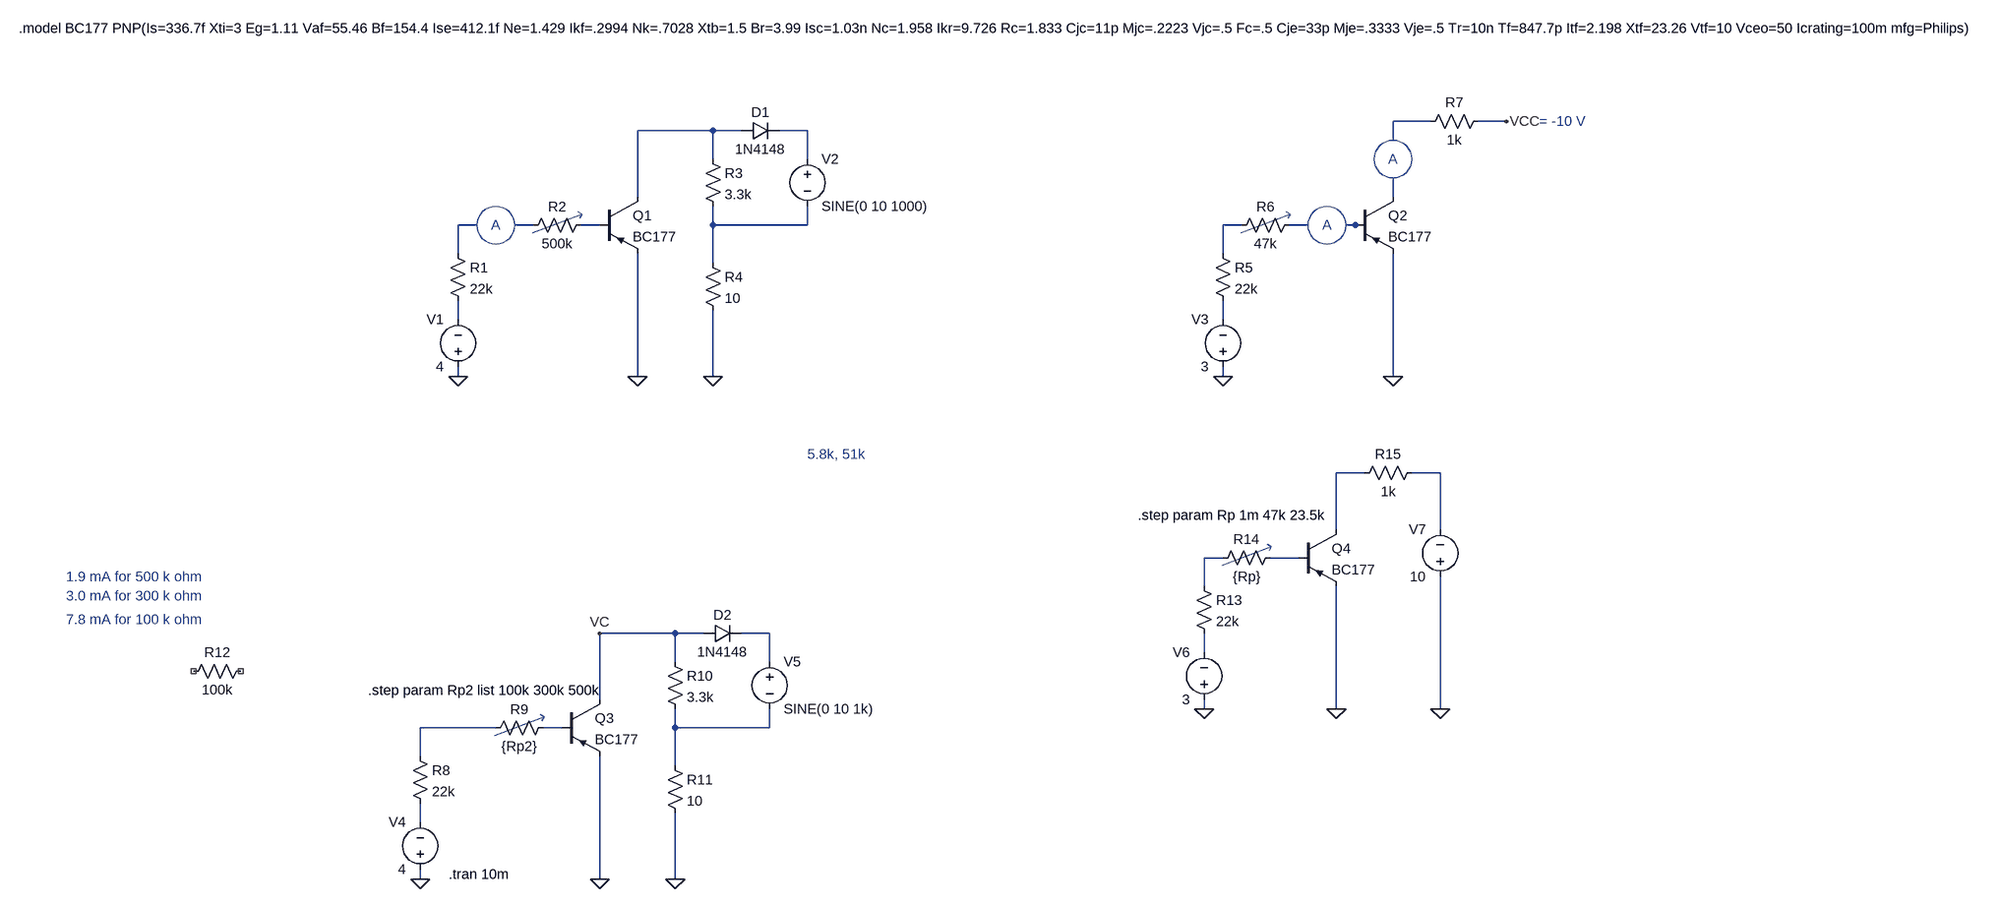
[diagram p0: schematic pre3.asc]
pre3.asc, the LTspice schematic file:
Version 4.1
SHEET 1 2712 1288
WIRE 1648 -224 1584 -224
WIRE 1776 -224 1728 -224
WIRE 432 -208 304 -208
WIRE 480 -208 432 -208
WIRE 592 -208 544 -208
WIRE 1584 -192 1584 -224
WIRE 432 -160 432 -208
WIRE 592 -160 592 -208
WIRE 304 -96 304 -208
WIRE 1584 -96 1584 -128
WIRE 32 -48 0 -48
WIRE 128 -48 96 -48
WIRE 240 -48 208 -48
WIRE 432 -48 432 -80
WIRE 592 -48 592 -80
WIRE 592 -48 432 -48
WIRE 1328 -48 1296 -48
WIRE 1440 -48 1408 -48
WIRE 1520 -48 1504 -48
WIRE 1536 -48 1520 -48
WIRE 0 0 0 -48
WIRE 1296 0 1296 -48
WIRE 432 16 432 -48
WIRE 0 112 0 80
WIRE 1296 112 1296 80
WIRE 0 208 0 192
WIRE 304 208 304 0
WIRE 432 208 432 96
WIRE 1296 208 1296 192
WIRE 1584 208 1584 0
WIRE 1536 560 1488 560
WIRE 1664 560 1616 560
WIRE 1488 656 1488 560
WIRE 1664 656 1664 560
WIRE 1296 704 1264 704
WIRE 1424 704 1376 704
WIRE 1264 752 1264 704
WIRE 368 832 240 832
WIRE 416 832 368 832
WIRE 528 832 480 832
WIRE 1264 864 1264 832
WIRE 368 880 368 832
WIRE 528 880 528 832
WIRE 240 944 240 832
WIRE 1264 960 1264 944
WIRE 1488 960 1488 752
WIRE 1664 960 1664 736
WIRE 64 992 -64 992
WIRE 176 992 144 992
WIRE 368 992 368 960
WIRE 528 992 528 960
WIRE 528 992 368 992
WIRE -64 1040 -64 992
WIRE 368 1056 368 992
WIRE -64 1152 -64 1120
WIRE -64 1248 -64 1232
WIRE 240 1248 240 1040
WIRE 368 1248 368 1136
FLAG 304 208 0
FLAG 0 208 0
FLAG 432 208 0
FLAG 1584 208 0
FLAG 1296 208 0
FLAG 1776 -224 VCC
FLAG 240 1248 0
FLAG -64 1248 0
FLAG 368 1248 0
FLAG 240 832 VC
FLAG 1488 960 0
FLAG 1264 960 0
FLAG 1664 960 0
SYMBOL voltage 0 208 R180
WINDOW 0 24 96 Left 2
WINDOW 3 24 16 Left 2
WINDOW 123 0 0 Left 0
WINDOW 39 0 0 Left 0
SYMATTR InstName V1
SYMATTR Value 4
SYMBOL res -16 -16 R0
SYMATTR InstName R1
SYMATTR Value 22k
SYMBOL res 224 -64 R90
WINDOW 0 0 56 VBottom 2
WINDOW 3 32 56 VTop 2
SYMATTR InstName R2
SYMATTR Value 500k
SYMBOL pnp 240 -96 R0
SYMATTR InstName Q1
SYMATTR Value BC177
SYMBOL res 416 -176 R0
SYMATTR InstName R3
SYMATTR Value 3.3k
SYMBOL res 416 0 R0
SYMATTR InstName R4
SYMATTR Value 10
SYMBOL voltage 592 -176 R0
WINDOW 123 0 0 Left 0
WINDOW 39 0 0 Left 0
SYMATTR InstName V2
SYMATTR Value SINE(0 10 1000)
SYMBOL diode 480 -192 R270
WINDOW 0 32 32 VTop 2
WINDOW 3 0 32 VBottom 2
SYMATTR InstName D1
SYMATTR Value 1N4148
SYMBOL voltage 1296 208 R180
WINDOW 0 24 96 Left 2
WINDOW 3 24 16 Left 2
WINDOW 123 0 0 Left 0
WINDOW 39 0 0 Left 0
SYMATTR InstName V3
SYMATTR Value 3
SYMBOL res 1280 -16 R0
SYMATTR InstName R5
SYMATTR Value 22k
SYMBOL res 1424 -64 R90
WINDOW 0 0 56 VBottom 2
WINDOW 3 32 56 VTop 2
SYMATTR InstName R6
SYMATTR Value 47k
SYMBOL pnp 1520 -96 R0
SYMATTR InstName Q2
SYMATTR Value BC177
SYMBOL res 1744 -240 R90
WINDOW 0 0 56 VBottom 2
WINDOW 3 32 56 VTop 2
SYMATTR InstName R7
SYMATTR Value 1k
SYMBOL voltage -64 1248 R180
WINDOW 0 24 96 Left 2
WINDOW 3 24 16 Left 2
WINDOW 123 0 0 Left 0
WINDOW 39 0 0 Left 0
SYMATTR InstName V4
SYMATTR Value 4
SYMBOL res -80 1024 R0
SYMATTR InstName R8
SYMATTR Value 22k
SYMBOL res 160 976 R90
WINDOW 0 0 56 VBottom 2
WINDOW 3 32 56 VTop 2
SYMATTR InstName R9
SYMATTR Value {Rp2}
SYMBOL pnp 176 944 R0
SYMATTR InstName Q3
SYMATTR Value BC177
SYMBOL res 352 864 R0
SYMATTR InstName R10
SYMATTR Value 3.3k
SYMBOL res 352 1040 R0
SYMATTR InstName R11
SYMATTR Value 10
SYMBOL voltage 528 864 R0
WINDOW 123 0 0 Left 0
WINDOW 39 0 0 Left 0
SYMATTR InstName V5
SYMATTR Value SINE(0 10 1k)
SYMBOL diode 416 848 R270
WINDOW 0 32 32 VTop 2
WINDOW 3 0 32 VBottom 2
SYMATTR InstName D2
SYMATTR Value 1N4148
SYMBOL res -352 880 R90
WINDOW 0 0 56 VBottom 2
WINDOW 3 32 56 VTop 2
SYMATTR InstName R12
SYMATTR Value 100k
SYMBOL voltage 1264 960 R180
WINDOW 0 24 96 Left 2
WINDOW 3 24 16 Left 2
WINDOW 123 0 0 Left 0
WINDOW 39 0 0 Left 0
SYMATTR InstName V6
SYMATTR Value 3
SYMBOL res 1248 736 R0
SYMATTR InstName R13
SYMATTR Value 22k
SYMBOL res 1392 688 R90
WINDOW 0 0 56 VBottom 2
WINDOW 3 32 56 VTop 2
SYMATTR InstName R14
SYMATTR Value {Rp}
SYMBOL pnp 1424 656 R0
SYMATTR InstName Q4
SYMATTR Value BC177
SYMBOL res 1632 544 R90
WINDOW 0 0 56 VBottom 2
WINDOW 3 32 56 VTop 2
SYMATTR InstName R15
SYMATTR Value 1k
SYMBOL voltage 1664 752 R180
WINDOW 0 24 96 Left 2
WINDOW 3 24 16 Left 2
SYMATTR InstName V7
SYMATTR Value 10
TEXT 64 -48 Center 2 ;A
TEXT 1472 -48 Center 2 ;A
TEXT 1584 -160 Center 2 ;A
TEXT 1832 -224 Left 2 ;= -10 V
TEXT -16 1240 Left 2 !.tran 10m
TEXT -152 928 Left 2 !.step param Rp2 list 100k 300k 500k
TEXT -664 736 Left 2 ;1.9 mA for 500 k ohm
TEXT -664 768 Left 2 ;3.0 mA for 300 k ohm
TEXT -664 808 Left 2 ;7.8 mA for 100 k ohm
TEXT 592 528 Left 2 ;5.8k, 51k
TEXT 1152 632 Left 2 !.step param Rp 1m 47k 23.5k
TEXT -744 -432 Left 2 !.model BC177 PNP(Is=336.7f Xti=3 Eg=1.11 Vaf=55.46 Bf=154.4 Ise=412.1f Ne=1.429 Ikf=.2994 Nk=.7028 Xtb=1.5 Br=3.99 Isc=1.03n Nc=1.958 Ikr=9.726 Rc=1.833 Cjc=11p Mjc=.2223 Vjc=.5 Fc=.5 Cje=33p Mje=.3333 Vje=.5 Tr=10n Tf=847.7p Itf=2.198 Xtf=23.26 Vtf=10 Vceo=50 Icrating=100m mfg=Philips)
LINE Normal 210 -67 126 -35
LINE Normal 206 -60 210 -67
LINE Normal 203 -71 210 -67
LINE Normal 1410 -67 1326 -35
LINE Normal 1406 -60 1410 -67
LINE Normal 1403 -71 1410 -67
LINE Normal 146 973 62 1005
LINE Normal 142 980 146 973
LINE Normal 139 969 146 973
LINE Normal 1378 685 1294 717
LINE Normal 1374 692 1378 685
LINE Normal 1371 681 1378 685
CIRCLE Normal 96 -16 32 -80
CIRCLE Normal 1504 -16 1440 -80
CIRCLE Normal 1616 -128 1552 -192

The netlist it stands for:
* pre3.asc
V1 0 N012 4
R1 N005 N012 22k
R2 N007 N006 500k
Q1 N002 N007 0 0 BC177
R3 N002 N008 3.3k
R4 N008 0 10
V2 N003 N008 SINE(0 10 1000)
D1 N002 N003 1N4148
V3 0 N013 3
R5 N009 N013 22k
R6 N010 N009 47k
Q2 N004 N011 0 0 BC177
R7 VCC N001 1k
V4 0 N023 4
R8 N020 N023 22k
R9 N021 N020 {Rp2}
Q3 VC N021 0 0 BC177
R10 VC N022 3.3k
R11 N022 0 10
V5 N018 N022 SINE(0 10 1k)
D2 VC N018 1N4148
R12 NC_01 NC_02 100k
V6 0 N019 3
R13 N016 N019 22k
R14 N017 N016 {Rp}
Q4 N014 N017 0 0 BC177
R15 N015 N014 1k
V7 0 N015 10
.model D D
.lib standard.dio
.model NPN NPN
.model PNP PNP
.lib standard.bjt
* A
* A
* A
* = -10 V
.tran 10m
.step param Rp2 list 100k 300k 500k
* 1.9 mA for 500 k ohm
* 3.0 mA for 300 k ohm
* 7.8 mA for 100 k ohm
* 5.8k, 51k
.step param Rp 1m 47k 23.5k
.model BC177 PNP(Is=336.7f Xti=3 Eg=1.11 Vaf=55.46 Bf=154.4 Ise=412.1f Ne=1.429 Ikf=.2994 Nk=.7028 Xtb=1.5 Br=3.99 Isc=1.03n Nc=1.958 Ikr=9.726 Rc=1.833 Cjc=11p Mjc=.2223 Vjc=.5 Fc=.5 Cje=33p Mje=.3333 Vje=.5 Tr=10n Tf=847.7p Itf=2.198 Xtf=23.26 Vtf=10 Vceo=50 Icrating=100m mfg=Philips)
.backanno
.end